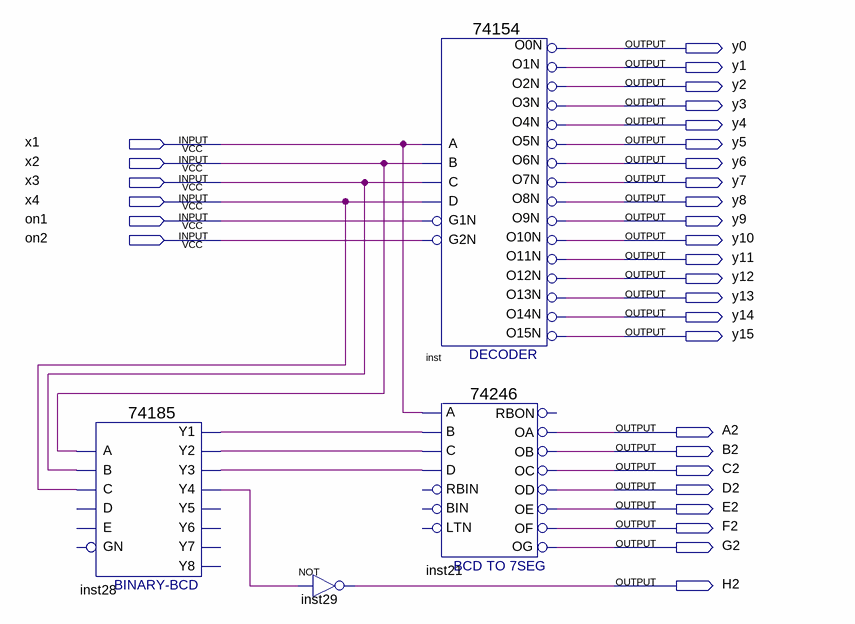
[diagram p0: schematic sheet]
// Quartus schematic cmb2.bdf as structural Verilog: 4 symbols, 30 pins
module cmb2 (
  input  x1,
  input  x2,
  input  x3,
  input  x4,
  input  on1,
  input  on2,
  output y0,
  output y1,
  output y2,
  output y3,
  output y4,
  output y5,
  output y6,
  output y7,
  output y8,
  output y9,
  output y10,
  output y11,
  output y12,
  output y13,
  output y14,
  output y15,
  output A2,
  output B2,
  output C2,
  output D2,
  output E2,
  output F2,
  output G2,
  output H2
);

  wire inst28_y1, inst28_y2, inst28_y3, inst28_y4;

  \74185  inst28 (
    .A(x2), .B(x3), .C(x4), .Y1(inst28_y1), .Y3(inst28_y3), .Y2(inst28_y2), .Y4(inst28_y4));  // open: D, E, GN, Y5, Y6, Y8, Y7
  not inst29 (H2, inst28_y4);
  \74154  inst (
    .C(x3), .D(x4), .B(x2), .A(x1), .G1N(on1), .G2N(on2), .O0N(y0), .O12N(y12), .O15N(y15), .O10N(y10),
    .O11N(y11), .O1N(y1), .O13N(y13), .O14N(y14), .O4N(y4), .O3N(y3), .O2N(y2), .O7N(y7), .O6N(y6), .O5N(y5),
    .O9N(y9), .O8N(y8));
  \74246  inst21 (
    .B(inst28_y1), .A(x1), .D(inst28_y3), .C(inst28_y2), .OD(D2), .OC(C2), .OB(B2), .OE(E2), .OF(F2),
    .OA(A2), .OG(G2));  // open: RBIN, LTN, BIN, RBON
endmodule
